# Altium schematic sheet GPO_IF.SchDoc
size A4; SheetNumber: 6; SheetTotal: 13
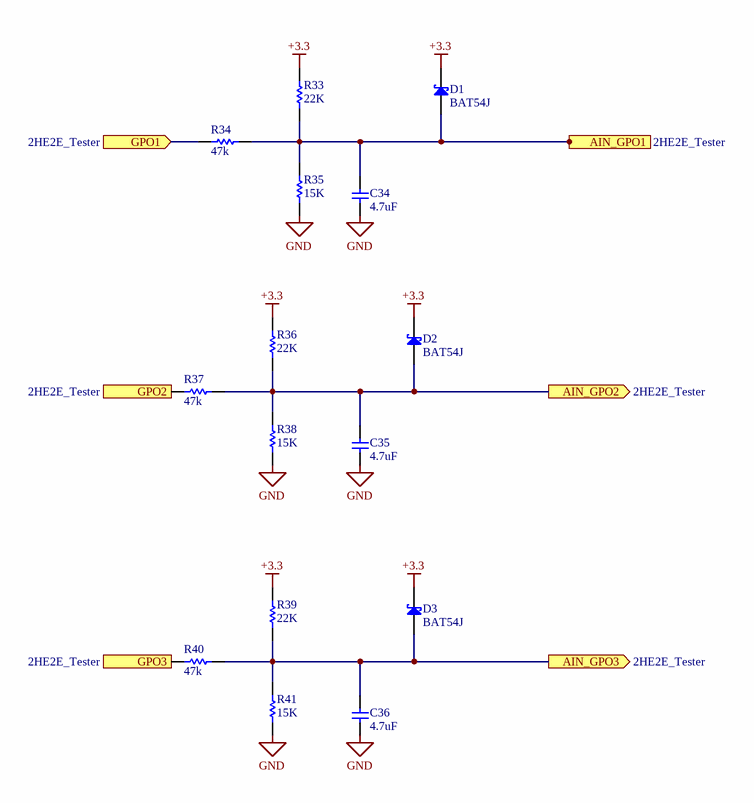
[diagram p0: GPO_IF.SchDoc]

## Parts
C34  value 4.7uF  [0603M-C]  (hidden comment: Cap Ceramic)
C35  value 4.7uF  [0603M-C]  (hidden comment: Cap Ceramic)
C36  value 4.7uF  [0603M-C]  (hidden comment: Cap Ceramic)
D1  BAT54J  [SOD323]
D2  BAT54J  [SOD323]
D3  BAT54J  [SOD323]
R33  value 22K  [0603M]  (hidden comment: Resistor)
R34  value 47k  [0603M]  (hidden comment: Resistor)
R35  value 15K  [0603M]  (hidden comment: Resistor)
R36  value 22K  [0603M]  (hidden comment: Resistor)
R37  value 47k  [0603M]  (hidden comment: Resistor)
R38  value 15K  [0603M]  (hidden comment: Resistor)
R39  value 22K  [0603M]  (hidden comment: Resistor)
R40  value 47k  [0603M]  (hidden comment: Resistor)
R41  value 15K  [0603M]  (hidden comment: Resistor)

## Ports
AIN_GPO1 (out, see 2HE2E_Tester), AIN_GPO2 (out, see 2HE2E_Tester), AIN_GPO3 (out, see 2HE2E_Tester), GPO1 (in, see 2HE2E_Tester), GPO2 (in, see 2HE2E_Tester), GPO3 (in, see 2HE2E_Tester)

## Nets
+3.3: D1.2(K) D2.2(K) D3.2(K) R33.2 R36.2 R39.2
GND: C34.1 C35.1 C36.1 R35.1 R38.1 R41.1
AIN_GPO1: C34.2 D1.1(A) R33.1 R34.2 R35.2 ; port AIN_GPO1
AIN_GPO2: C35.2 D2.1(A) R36.1 R37.2 R38.2 ; port AIN_GPO2
AIN_GPO3: C36.2 D3.1(A) R39.1 R40.2 R41.2 ; port AIN_GPO3
GPO1: R34.1 ; port GPO1
GPO2: R37.1 ; port GPO2
GPO3: R40.1 ; port GPO3

## Notes on the sheet
- Title
- Size:
- Date:
- A4
- Number:
- Time:
- Revision:
- Sheet
- of
- File:

## Library data of the parts
C34-C36 = Cap Ceramic: Ceramic Capacitor
D1-D3 = Diodo Schottky